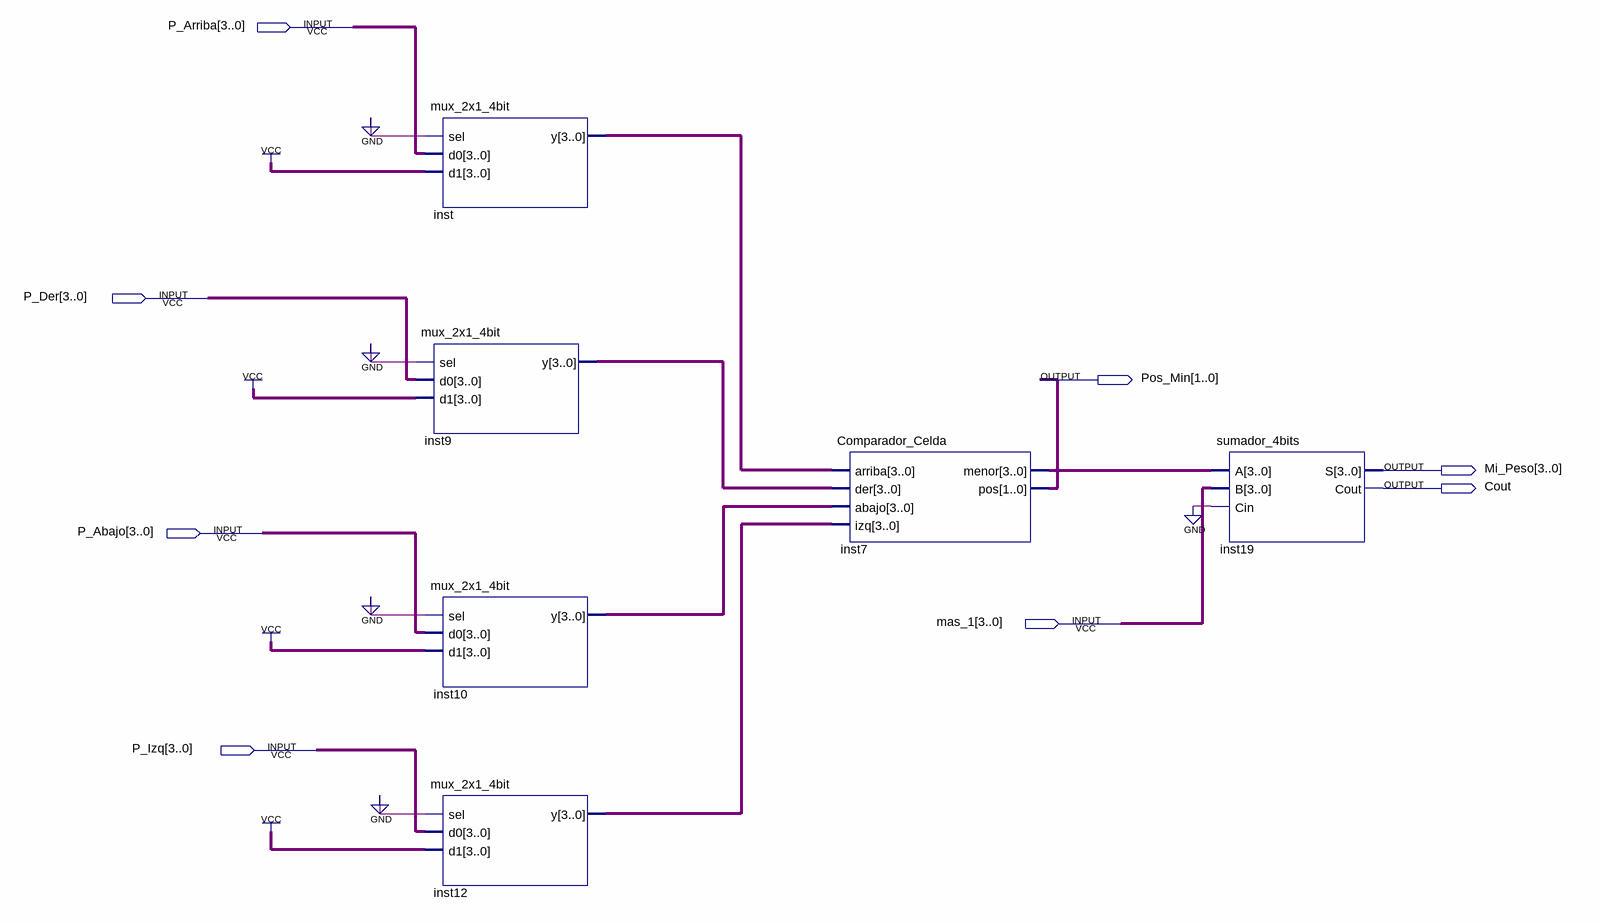
[diagram p0: schematic sheet]
// Quartus schematic floodfill_1celda_sim.bdf as structural Verilog: 6 symbols, 8 pins
module floodfill_1celda_sim (
  input  [3:0] P_Arriba,
  input  [3:0] P_Der,
  input  [3:0] P_Abajo,
  input  [3:0] mas_1,
  input  [3:0] P_Izq,
  output [1:0] Pos_Min,
  output [3:0] Mi_Peso,
  output Cout
);

  wire [3:0] inst7_menor, inst9_y, inst10_y, inst12_y, inst_y;

  mux_2x1_4bit inst (.sel(1'b0), .d0(P_Arriba), .d1(4'b1111), .y(inst_y));
  mux_2x1_4bit inst9 (.sel(1'b0), .d0(P_Der), .d1(4'b1111), .y(inst9_y));
  mux_2x1_4bit inst10 (.sel(1'b0), .d0(P_Abajo), .d1(4'b1111), .y(inst10_y));
  mux_2x1_4bit inst12 (.sel(1'b0), .d0(P_Izq), .d1(4'b1111), .y(inst12_y));
  Comparador_Celda inst7 (
    .arriba(inst_y), .der(inst9_y), .abajo(inst10_y), .izq(inst12_y), .menor(inst7_menor), .pos(Pos_Min));
  sumador_4bits inst19 (.A(inst7_menor), .B(mas_1), .Cin(1'b0), .S(Mi_Peso), .Cout(Cout));
endmodule
